# EAGLE design evse_ver3(擴充) (EAGLE 9.6.2)
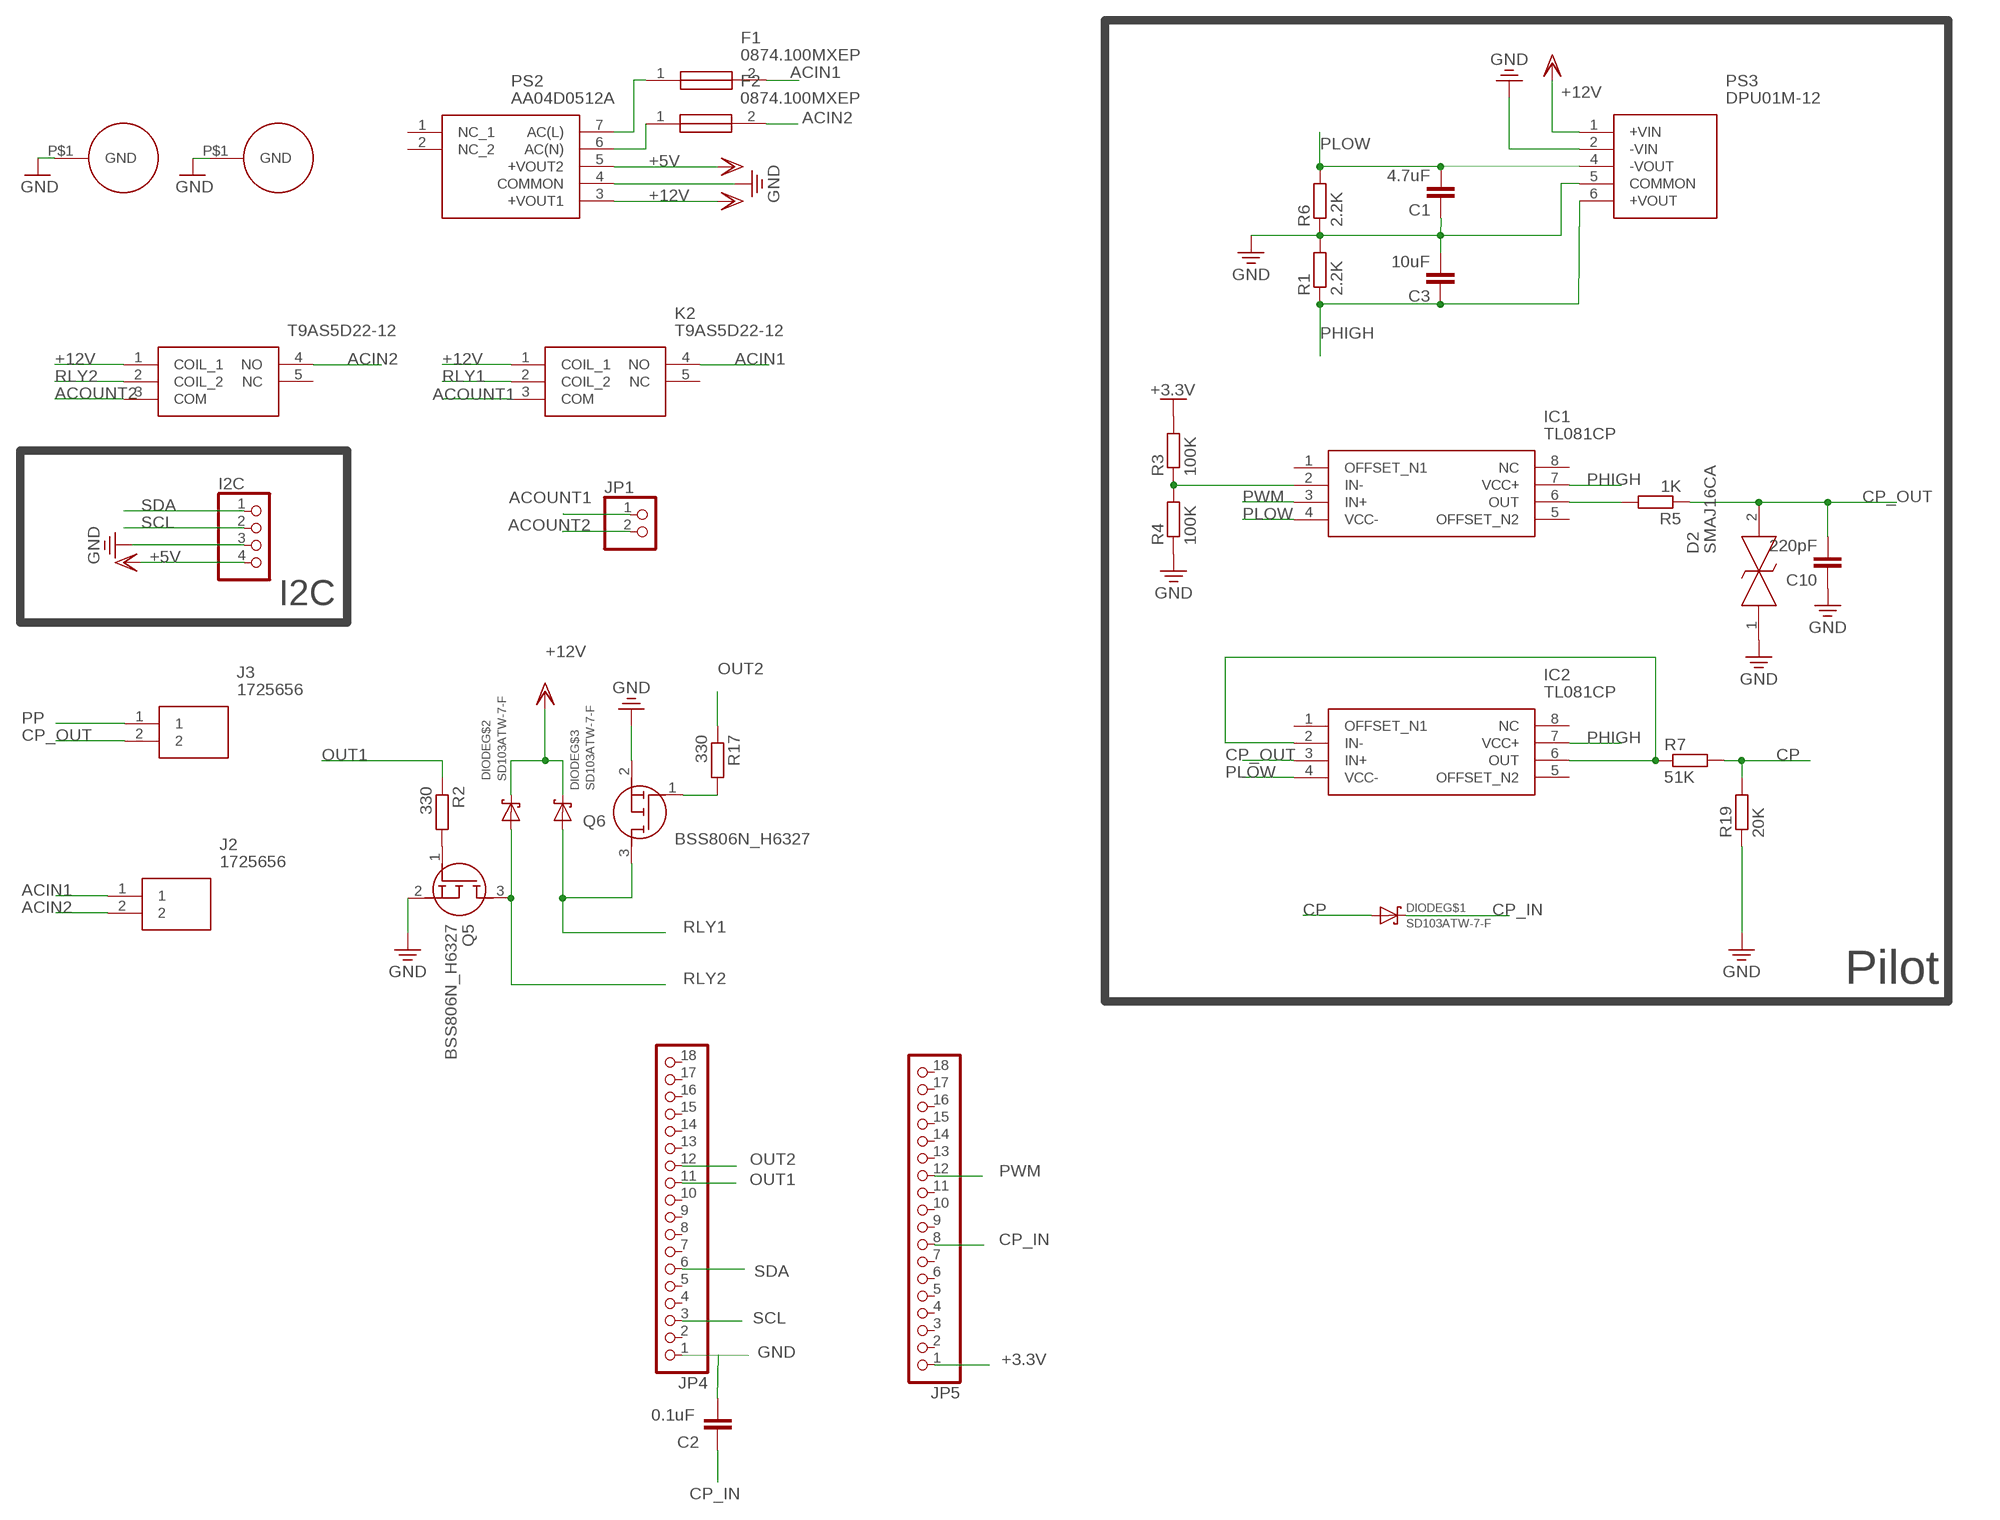
[diagram p0: schematic, sheet 1]

## Parts
C1  4.7uF  C-EUC0805  [C0805]
C2  0.1uF  C-EUC0805  [C0805]
C3  10uF  C-EUC0805  [C0805]
C10  220pF  C-EUC0805  [C0805]
D2  SMAJ16CA  [DIOM6626X229N]
DIODE  SD103ATW-7-F  [SOT363]
F1  0874.100MXEP  [0874100MXEP]
F2  0874.100MXEP  [0874100MXEP]
I2C  PINHD-1X4  [1X04]
IC1  TL081CP  [DIP794W53P254L959H508Q8N]
IC2  TL081CP  [DIP794W53P254L959H508Q8N]
J2  1725656  [1725656]
J3  1725656  [1725656]
JP1  PINHD-1X2  [1X02]
JP4  PINHD-1X18  [1X18]
JP5  PINHD-1X18  [1X18]
K2  T9AS5D22-12  [T9AS5D2224314191046]
K3  T9AS5D22-12  [T9AS5D2224314191046]
PS2  AA04D0512A  [AA04D0512A]
PS3  DPU01M-12  [DPU01M12]
Q5  BSS806N_H6327  [SOT95P240X110-3N]
Q6  BSS806N_H6327  [SOT95P240X110-3N]
R1  2.2K  R-EU_R0805  [R0805]
R2  330  R-EU_R0805  [R0805]
R3  100K  R-EU_R0805  [R0805]
R4  100K  R-EU_R0805  [R0805]
R5  1K  R-EU_R0805  [R0805]
R6  2.2K  R-EU_R0805  [R0805]
R7  51K  R-EU_R0805  [R0805]
R17  330  R-EU_R0805  [R0805]
R19  20K  R-EU_R0805  [R0805]
U$3  HOLE  [HOLE]
U$4  HOLE  [HOLE]

## Nets
+3.3V: JP5.1 R3.2
+5V: I2C.4 PS2.5(+VOUT2) ; supply symbol labelled VDD
+12V: DIODE.2(C) DIODE.3(C) K2.1(COIL_1) K3.1(COIL_1) PS2.3(+VOUT1) PS3.1(+VIN) ; supply symbol labelled VDD
ACIN1: F1.2 J2.1 K2.4(NO)
ACIN2: F2.2 J2.2 K3.4(NO)
ACOUNT1: JP1.1 K2.3(COM)
ACOUNT2: JP1.2 K3.3(COM)
CP: DIODE.6(A) R7.2 R19.2
CP_IN: C2.1 DIODE.1(C) JP5.8
CP_OUT: C10.2 D2.2 IC2.3(IN+) J3.2 R5.1
GND: C1.1 C2.2 C3.2 C10.1 D2.1 I2C.3 JP4.1 PS2.4(COMMON) PS3.2(-VIN) PS3.5(COMMON) Q5.2(S) Q6.2(S) R1.2 R4.1 R6.1 R19.1 U$3.P$1(GND) U$4.P$1(GND)
N$1: IC1.2(IN-) R3.1 R4.2
N$2: IC1.6(OUT) R5.2
N$4: Q5.1(G) R2.2
N$5: Q6.1(G) R17.2
N$6: IC2.2(IN-) IC2.6(OUT) R7.1
N$11: F2.1 PS2.6(AC(N))
N$12: F1.1 PS2.7(AC(L))
OUT1: JP4.11 R2.1
OUT2: JP4.12 R17.1
PHIGH: C3.1 IC1.7(VCC+) IC2.7(VCC+) PS3.6(+VOUT) R1.1
PLOW: C1.2 IC1.4(VCC-) IC2.4(VCC-) PS3.4(-VOUT) R6.2
PP: J3.1
PWM: IC1.3(IN+) JP5.12
RLY1: DIODE.4(A) K2.2(COIL_2) Q6.3(D)
RLY2: DIODE.5(A) K3.2(COIL_2) Q5.3(D)
SCL: I2C.2 JP4.3
SDA: I2C.1 JP4.6
Unconnected: IC1.1(OFFSET_N1) IC1.5(OFFSET_N2) IC1.8(NC) IC2.1(OFFSET_N1) IC2.5(OFFSET_N2) IC2.8(NC) JP4.2 JP4.4 JP4.5 JP4.7 JP4.8 JP4.9 JP4.10 JP4.13 JP4.14 JP4.15 JP4.16 JP4.17 JP4.18 JP5.2 JP5.3 JP5.4 JP5.5 JP5.6 JP5.7 JP5.9 JP5.10 JP5.11 JP5.13 JP5.14 JP5.15 JP5.16 JP5.17 JP5.18 K2.5(NC) K3.5(NC) PS2.1(NC_1) PS2.2(NC_2)

## Notes on the sheet
- I2C
- Pilot

## Library data of the parts
C1-C3 C10 = rcl:C-EU: CAPACITOR, European symbol
D2 = SMAJ16CA:SMAJ16CA: LITTELFUSE - SMAJ16CA - TVS Diode, SMAJ Series, Bidirectional, 16 V, 26 V, DO-214AC (SMA), 2 Pins Source: Datasheet <https://ms.componentsearchengine.com/Datasheets/2/SMAJ16CA.pdf>; DESCRIPTION: LITTELFUSE - SMAJ16CA - TVS Diode, SMAJ Series, Bidirectional, 16 V, 26 V, DO-214AC (SMA), 2 Pins; HEIGHT: 2.29mm; MANUFACTURER_NAME: LITTELFUSE; MANUFACTURER_PART_NUMBER: SMAJ16CA; MOUSER_PART_NUMBER: 576-SMAJ16CA; MOUSER_PRICE-STOCK: https://www.mouser.co.uk/ProductDetail/Littelfuse/SMAJ16CA?qs=zHiv0nsVGmph5UFEkGdy2g%3D%3D
DIODE = SD103ATW-7-F:SD103ATW-7-F: Diode array: 3x Such as http://www.digikey.com/product-search/en?part=SD103ATW-FDICT-ND Check availability <https://pricing.snapeda.com/parts/SD103ATW-7-F/Diodes%20Inc./view-part?ref=eda>; AVAILABILITY: In Stock; DESCRIPTION: Diode Array 3 Independent Schottky 40 V 175mA Surface Mount 6-TSSOP, SC-88, SOT-363; MF: Diodes Inc.; MP: SD103ATW-7-F; PACKAGE: SOT-363 Diodes Inc.; PRICE: None; PURCHASE-URL: https://pricing.snapeda.com/search/part/SD103ATW-7-F/?ref=eda
F1 F2 = 0874.100MXEP:0874.100MXEP: Cartridge Fuses 250V .100A 3.6X10 FA PT PB-FREE Source: Datasheet <https://componentsearchengine.com/Datasheets/1/0874.100MXEP.pdf>; DESCRIPTION: Cartridge Fuses 250V .100A 3.6X10 FA PT PB-FREE; HEIGHT: 3.6mm; MANUFACTURER_NAME: LITTELFUSE; MANUFACTURER_PART_NUMBER: 0874.100MXEP; MOUSER_PART_NUMBER: 576-0874.100MXEP; MOUSER_PRICE-STOCK: https://www.mouser.com/Search/Refine.aspx?Keyword=576-0874.100MXEP
I2C = pinhead:PINHD-1X4: PIN HEADER
IC1 IC2 = TL081CP:TL081CP: TL081CP, Operational Amplifier 3MHz, 8-Pin PDIP Source: Datasheet <http://www.ti.com/lit/ds/symlink/tl081a.pdf>; DESCRIPTION: TL081CP, Operational Amplifier 3MHz, 8-Pin PDIP; HEIGHT: 5.08mm; MANUFACTURER_NAME: Texas Instruments; MANUFACTURER_PART_NUMBER: TL081CP; MOUSER_PART_NUMBER: 595-TL081CP; MOUSER_PRICE-STOCK: https://www.mouser.co.uk/ProductDetail/Texas-Instruments/TL081CP?qs=xJkDX%2FqrskP5SC31s4Mqdg%3D%3D
J2 J3 = 1725656:1725656: PCB terminal block, nominal current: 6 A, rated voltage (III/2): 160 V, nominal cross section: 0.5 mm?, Number of potentials: 2, Number of rows: 1, Number of positions per row: 2, product range: MPT 0,5, pitch: 2.54 mm, connection method: Screw connection with tension sleeve, mounting: Wave soldering, conductor/PCB connection direction: 0 ?, color: green, Pin layout: Linear pinning, Solder pin [P]: 3.5 mm, type of packaging: packed in cardboard Source: Datasheet <https://www.phoenixcontact.com/online/portal/us/?uri=pxc-oc-itemdetail:pid=1725656&library=usen&pcck=P-11-01-05&tab=1&selectedCategory=ALL>; DESCRIPTION: PCB terminal block, nominal current: 6 A, rated voltage (III/2): 160 V, nominal cross section: 0.5 mm?, Number of potentials: 2, Number of rows: 1, Number of positions per row: 2, product range: MPT 0,5, pitch: 2.54 mm, connection method: Screw connection with tension sleeve, mounting: Wave soldering, conductor/PCB connection direction: 0 ?, color: green, Pin layout: Linear pinning, Solder pin [P]: 3.5 mm, type of packaging: packed in cardboard; HEIGHT: 8.65mm; MANUFACTURER_NAME: Phoenix Contact; MANUFACTURER_PART_NUMBER: 1725656; MOUSER_PART_NUMBER: 651-1725656; MOUSER_PRICE-STOCK: https://www.mouser.co.uk/ProductDetail/Phoenix-Contact/1725656?qs=Ul7CXFMnlWWQeccayYbRmw%3D%3D
JP1 = pinhead:PINHD-1X2: PIN HEADER
JP4 JP5 = pinhead:PINHD-1X18: PIN HEADER
K2 K3 = T9AS5D22-12:T9AS5D22-12: TE CONNECTIVITY / POTTER & BRUMFIELD - T9AS5D22-12 - RELAY, SPDT, 240VAC, 28VDC, 30A Source: Datasheet <https://componentsearchengine.com/Datasheets/1/T9AS5D22-12.pdf>; DESCRIPTION: TE CONNECTIVITY / POTTER & BRUMFIELD - T9AS5D22-12 - RELAY, SPDT, 240VAC, 28VDC, 30A; HEIGHT: mm; MANUFACTURER_NAME: TE Connectivity; MANUFACTURER_PART_NUMBER: T9AS5D22-12; MOUSER_PART_NUMBER: 655-T9AS5D22-12; MOUSER_PRICE-STOCK: https://www.mouser.co.uk/ProductDetail/TE-Connectivity-PB/T9AS5D22-12?qs=2jPFL06W5JVKA2uvXA%2F4Ew%3D%3D
PS2 = AA04D0512A:AA04D0512A: AC/DC Power Modules AC/DC Power Module, Dual Output, 5Vout, 12Vout, 4W Source: Datasheet <https://datasheet.datasheetarchive.com/originals/distributors/Datasheets-DGA21/91385.pdf>; DESCRIPTION: AC/DC Power Modules AC/DC Power Module, Dual Output, 5Vout, 12Vout, 4W; HEIGHT: 17.6mm; MANUFACTURER_NAME: Delta Electronics; MANUFACTURER_PART_NUMBER: AA04D0512A; MOUSER_PART_NUMBER: 108-AA04D0512A; MOUSER_PRICE-STOCK: https://www.mouser.co.uk/ProductDetail/Delta-Electronics/AA04D0512A/?qs=4hHWAozs7PZaLKDuE1lG%2FA%3D%3D
PS3 = DPU01M-12:DPU01M-12: Module DC-DC 12VIN 2-OUT 12V/-12V 0.042A/-0.042A 1W 5-Pin SIP Module Source: Datasheet <https://www.meanwell-web.com/content/files/pdfs/productPdfs/MW/DPU01/SPU01,DPU01-spec.pdf>; DESCRIPTION: Module DC-DC 12VIN 2-OUT 12V/-12V 0.042A/-0.042A 1W 5-Pin SIP Module; HEIGHT: 10.45mm; MANUFACTURER_NAME: Mean Well; MANUFACTURER_PART_NUMBER: DPU01M-12; MOUSER_PART_NUMBER: 709-DPU01M-12; MOUSER_PRICE-STOCK: https://www.mouser.co.uk/ProductDetail/MEAN-WELL/DPU01M-12?qs=5aG0NVq1C4yRPcZu7q8rLQ%3D%3D
Q5 Q6 = BSS806N_H6327:BSS806N_H6327: MOSFET N-Ch 20V 2.3A SOT-23-3 Source: Datasheet <https://www.mouser.it/datasheet/2/196/Infineon-BSS806N-DS-v02_03-en-918336.pdf>; DESCRIPTION: MOSFET N-Ch 20V 2.3A SOT-23-3; HEIGHT: 1.1mm; MANUFACTURER_NAME: Infineon; MANUFACTURER_PART_NUMBER: BSS806N H6327; MOUSER_PART_NUMBER: 726-BSS806NH6327XT; MOUSER_PRICE-STOCK: https://www.mouser.co.uk/ProductDetail/Infineon-Technologies/BSS806N-H6327?qs=oPPfIaWL1l2rNBcPXSFY%252BQ%3D%3D
R1-R7 R17 R19 = rcl:R-EU_: RESISTOR, European symbol
U$3 U$4 = OpenEVSE:HOLE

## Board
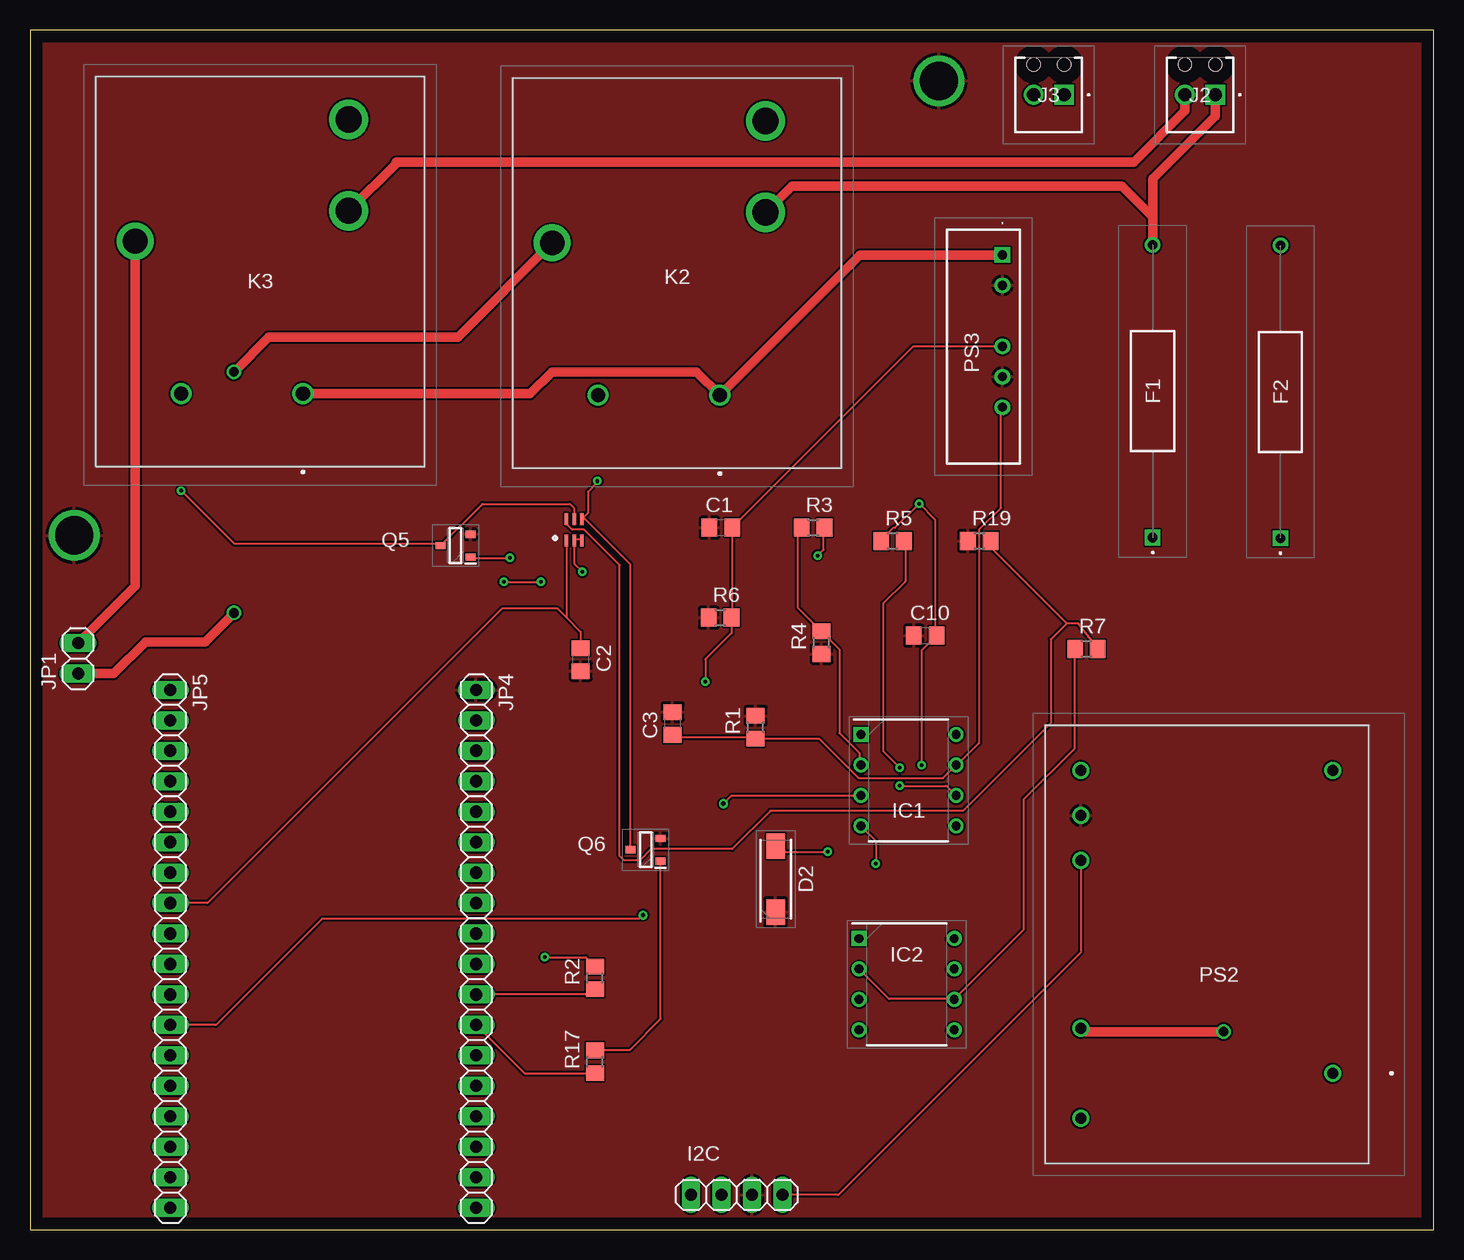
[diagram p1: board, top side]
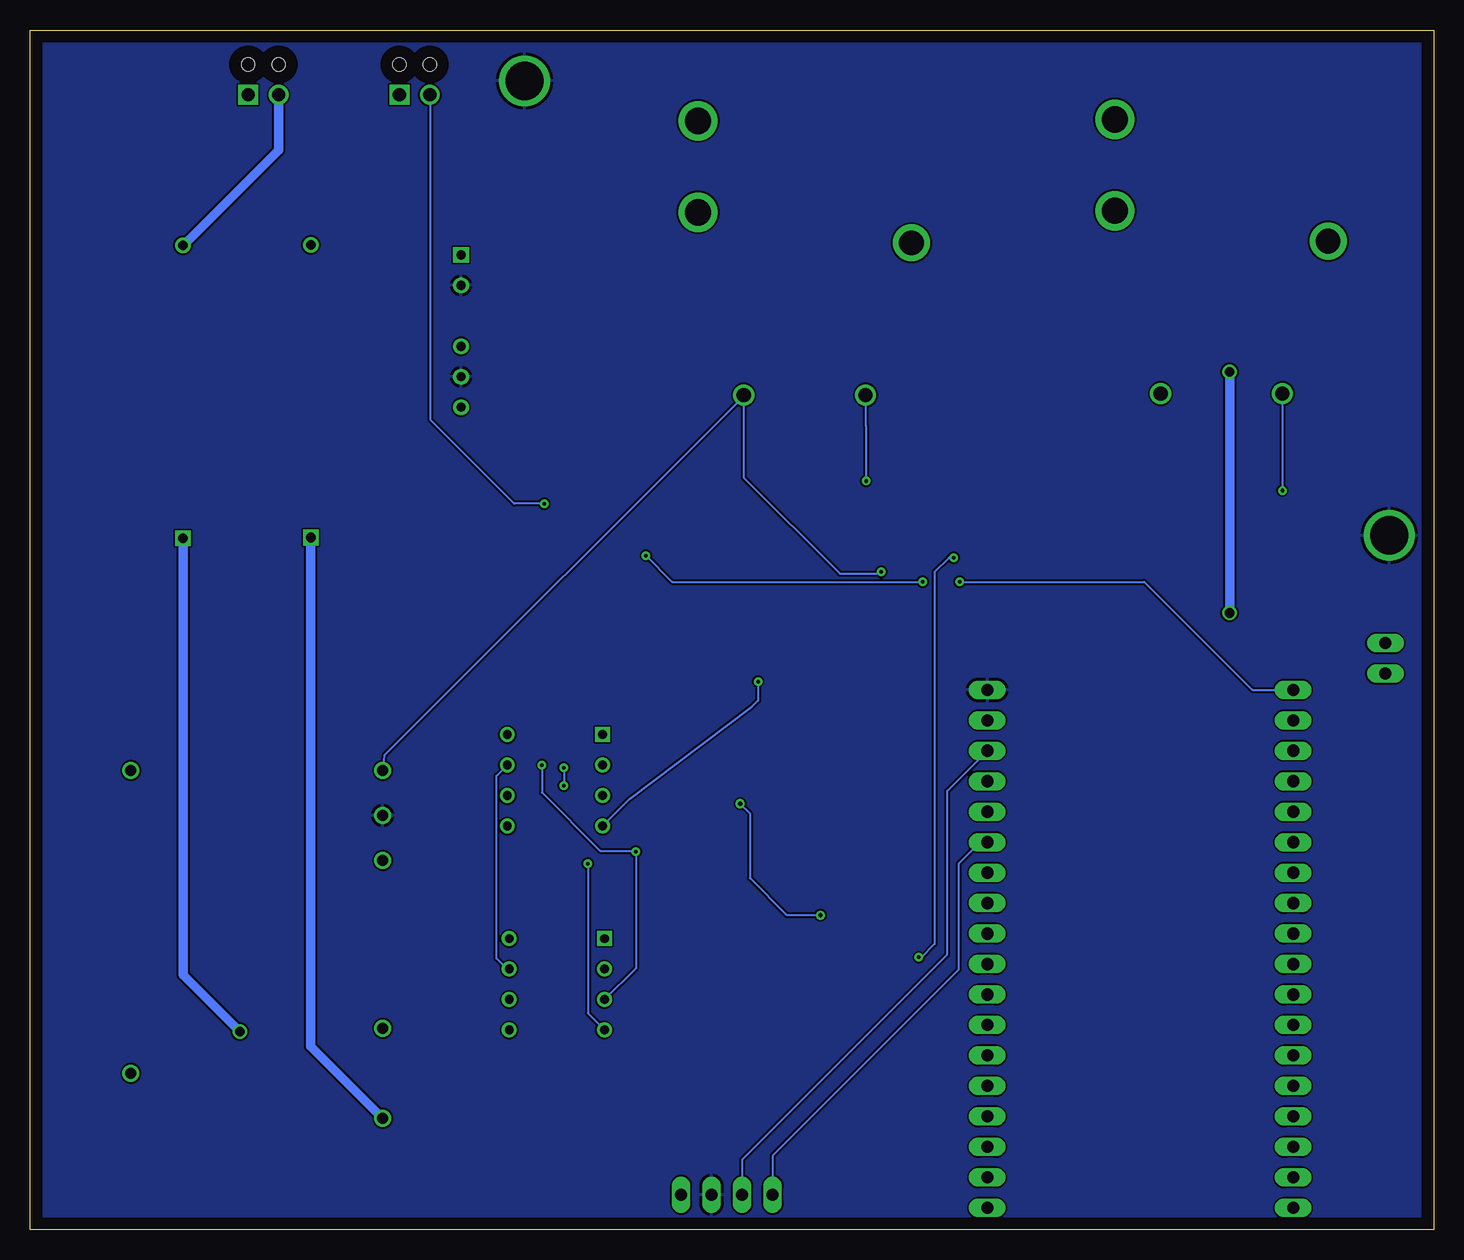
[diagram p2: board, bottom side, seen from below]

Size 117 x 100 mm. Coordinates in mm from the lower left corner, seen from the top.
Outline: 0,0 117,0 117,100 0,100 0,0
Copper layers (1*16): Top 0.035mm / dielectric 1.5mm / Bottom 0.035mm
Design rules "default *": minimum track width 0.18mm, minimum drill 0.3mm, track to track 6mil, track to pad 6mil, pad to pad 6mil, via to via 6mil, smd to smd 6mil, copper to edge 40mil, drill to drill 6mil, minimum pad ring 10mil, minimum via ring 8mil, stop-mask expansion 4mil, vias tented up to drill 0mil, thermal gap 10mil

### Footprints (pad centres in the part's own frame; a part is rotated, then mirrored left to right if it is on the bottom)
C0805 = smd 1.3 x 1.5: 1 -0.95,0; 2 0.95,0
DIOM6626X229N = smd 2.15 x 1.55: 1 -2.75,0; 2 2.75,0
SOT363 = smd 0.3 x 1: 1 -0.65,-0.9; 2 0,-0.9; 3 0.65,-0.9; 4 0.65,0.9; 5 0,0.9; 6 -0.65,0.9
0874100MXEP = drill 0.8 pad 1.3 square: 1 0,0 | drill 0.8 pad 1.3: 2 24.4,0
1X04 = drill 1.016 long: 1 -3.81,0; 2 -1.27,0; 3 1.27,0; 4 3.81,0
DIP794W53P254L959H508Q8N = drill 0.73 pad 1.13 square: 1 -3.97,3.81 | drill 0.73 pad 1.13: 2 -3.97,1.27; 3 -3.97,-1.27; 4 -3.97,-3.81; 5 3.97,-3.81; 6 3.97,-1.27; 7 3.97,1.27; 8 3.97,3.81
1725656 = drill 1.1 pad 1.65 square: 1 0,0 | drill 1.1 pad 1.65: 2 2.54,0 | hole 1.1: 0,-2.54; 2.54,-2.54
1X02 = drill 1.016 long: 1 -1.27,0; 2 1.27,0
1X18 = drill 1.016 long: 1 -21.59,0; 2 -19.05,0; 3 -16.51,0; 4 -13.97,0; 5 -11.43,0; 6 -8.89,0; 7 -6.35,0; 8 -3.81,0; 9 -1.27,0; 10 1.27,0; 11 3.81,0; 12 6.35,0; 13 8.89,0; 14 11.43,0; 15 13.97,0; 16 16.51,0; 17 19.05,0; 18 21.59,0
T9AS5D2224314191046 = drill 1.17 pad 1.755: 1 3.81,22.86; 2 13.97,22.86 | drill 2.06 pad 3.09: 3 17.78,10.16 | drill 2.19 pad 3.285: 4 0,7.62; 5 0,0
AA04D0512A = drill 0.9 pad 1.4: 1 0,0; 2 0,-25.25; 3 21,-25.25; 4 21,-21.5; 5 21,-17.75; 6 21,-3.75; 7 21,3.75
DPU01M12 = drill 0.76 pad 1.303 square: 1 0,0 | drill 0.76 pad 1.303: 2 2.54,0; 4 7.62,0; 5 10.16,0; 6 12.7,0
SOT95P240X110-3N = smd 0.85 x 0.6: 1 -1.25,0.95; 2 -1.25,-0.95; 3 1.25,0
R0805 = smd 1.3 x 1.5: 1 -0.95,0; 2 0.95,0
HOLE = drill 3.2 pad 3.81: P$1 0,0

### Placement (x,y rotation side)
C1  57.58,58.52 0 top
C2  45.9,47.5 270 top
C3  53.58,42.18 90 top
C10  74.63,49.52 0 top
D2  62.16,29.21 90 top
DIODE  45.36,58.34 0 top
F1  93.59,57.69 90 top
F2  104.24,57.63 90 top
I2C  58.91,2.89 0 top
IC1  73.24,37.45 0 top
IC2  73.08,20.45 0 top
J2  98.81,94.6 180 top
J3  86.2,94.6 180 top
JP1  4.01,47.62 90 top
JP4  37.2,23.4 270 top
JP5  11.7,23.4 270 top
K2  61.31,92.42 180 top
K3  26.56,92.55 180 top
PS2  108.6,13.02 180 top
PS3  81.06,81.25 270 top
Q5  35.47,57.01 180 top
Q6  51.32,31.66 180 top
R1  60.48,41.88 90 top
R2  47.09,20.98 90 top
R3  65.28,58.52 0 top
R4  65.98,48.93 90 top
R5  71.9,57.41 0 top
R6  57.53,51.02 0 top
R7  88.06,48.41 0 top
R17  47.09,13.99 90 top
R19  79.14,57.41 0 top
U$3  75.77,95.76 0 top
U$4  3.69,57.86 0 top

### Tracks (layer width: path | path; a pad name or v marks a point on that pad's centre or on a via)
+3.3V  (via drill 0.3)
  Top 0.18: v65.65,56.17 66.15,56.67 66.15,58.5 R3.2 | v39.5,54 v42.58,54
  Bottom 0.18: v65.65,56.17 63.48,54 v42.58,54 | JP5.1 15.1,44.99 24.11,54 v39.5,54
+5V
  Top 0.18: PS2.5 87.59,30.75 87.59,23.1 67.38,2.89 I2C.4
+12V  (via drill 0.3)
  Top 0.18: DIODE.3 45.87,57.51 45.37,57.51 DIODE.2 45.37,57.34 45.37,55.51 v46.04,54.84
  Top 0.8: K3.1 41.69,69.69 43.5,71.5 55.56,71.5 K2.1 69.19,81.25 PS3.1
  Bottom 0.18: v46.04,54.84 46.2,54.68 49.5,54.68 57.49,62.66 57.49,69.49 | K2.1 57.45,69.53 57.49,69.49 | 57.49,69.49 87.47,39.51 PS2.3
ACIN1
  Top 0.8: K2.4 63.51,87 91,87 93.59,84.41 F1.2 93.59,87.59 98.81,92.81 J2.1
ACIN2
  Top 0.8: K3.4 30.5,88.87 30.5,89 92,89 96.27,93.27 J2.2
  Bottom 0.8: J2.2 96.27,90 F2.2
ACOUNT1  (via drill 0.81)
  Top 0.8: K2.3 35.67,74.4 19.9,74.4 v17,71.5 | v17,51.4 14.6,49 9.64,49 6.99,46.35 JP1.1
  Bottom 0.8: v17,71.5 v17,51.4
ACOUNT2
  Top 0.8: JP1.2 8.78,53.66 K3.3
CP
  Top 0.18: 86.42,50.53 85.09,49.2 85.09,42.21 77.78,34.9 61.72,34.9 58.53,31.71 51.78,31.71 50.85,30.78 49.53,30.78 49.16,31.15 49.16,55.38 46.2,58.34 45.21,58.34 44.71,58.84 44.71,59.17 DIODE.6 | 86.42,50.53 87.37,50.53 R7.2 | 86.42,50.53 80.11,56.84 80.11,57.34 R19.2
CP_IN
  Top 0.18: 44.71,51.02 43.98,51.75 39.35,51.75 14.81,27.21 JP5.8 | DIODE.1 44.71,51.02 | C2.1 45.9,49.83 44.71,51.02
CP_OUT  (via drill 0.3)
  Top 0.18: D2.2 62.62,31.5 v66.5,31.5 | R5.1 70.97,57.51 71.97,58.5 72.12,58.5 v74.12,60.5 75.45,59.17 75.45,49.53 C10.2 74.32,48.26 v74.32,38.73
  Bottom 0.18: IC2.3 66.5,21.79 v66.5,31.5 66.65,31.58 69.47,31.58 74.32,36.42 v74.32,38.73 | v74.12,60.5 76.62,60.5 83.6,67.48 83.6,94.57 J3.2
GND
  pour Top: -8,102 -8,-5 122,-5 122,102
  pour Bottom: -10,103 -10,-8 -6,-8 126,-8 126,-1 126,103
N$1
  Top 0.18: R3.1 63.99,58.18 63.99,51.86 65.81,50.03 R4.2 65.98,49.86 67.48,48.36 67.48,41.38 69.14,39.72 69.14,38.73 IC1.2
N$2  (via drill 0.3)
  Top 0.18: R5.2 72.96,57.34 72.96,54.03 71.12,52.19 71.12,39.88 v72.5,38.5 | v72.5,37 76.39,37 IC1.6
  Bottom 0.18: v72.5,38.5 v72.5,37
N$4  (via drill 0.3)
  Top 0.18: Q5.1 36.78,56 v40,56 | v42.9,22.7 46.32,22.7 R2.2
  Bottom 0.18: v40,56 40.4,56 41.6,54.8 41.6,23.8 42.7,22.7 v42.9,22.7
N$5
  Top 0.18: R17.2 47.15,15 50,15 52.57,17.57 Q6.1
N$6
  Top 0.18: R7.1 87.09,48.36 87.09,40.12 82.85,35.88 82.85,25.01 77.12,19.28 IC2.6 77.01,19.22 71.61,19.22 IC2.2
N$11  (via drill 0.81)
  Top 0.8: v99.5,16.5 87.87,16.5 PS2.6
  Bottom 0.8: F2.1 104.24,21.24 v99.5,16.5
N$12
  Bottom 0.8: PS2.7 93.59,15.26 F1.1
OUT1
  Top 0.18: JP4.11 46.65,19.59 R2.1
OUT2
  Top 0.18: JP4.12 41.21,13.04 R17.1
PHIGH
  Top 0.18: C3.1 53.63,41.05 60.33,41.05 R1.1 60.5,40.88 65.81,40.88 69.07,37.63 76.12,37.63 IC1.7 77.28,38.72 79.11,40.55 79.11,58.34 80.94,60.16 80.94,68.47 PS3.6
  Bottom 0.18: IC2.7 77.23,21.72 78.11,22.6 78.11,37.82 IC1.7
PLOW  (via drill 0.3)
  Top 0.18: IC1.4 69.31,33.57 70.5,32.38 v70.5,30.5 | PS3.4 80.94,73.63 73.63,73.63 58.67,58.67 C1.2 58.5,58.5 58.5,51.02 R6.2 58.48,49.72 56.3,47.54 v56.3,45.67
  Bottom 0.18: v56.3,45.67 56.3,44.1 56.81,43.59 67.01,35.9 IC1.4 | v70.5,30.5 70.5,18.03 IC2.4
PWM  (via drill 0.35)
  Top 0.18: v57.8,35.5 58.48,36.18 IC1.3 | v51.1,26.2 50.8,25.9 24.35,25.9 15.5,17.05 JP5.12
  Bottom 0.18: v51.1,26.2 53.9,26.2 57,29.3 57,34.7 v57.8,35.5
RLY1  (via drill 0.3)
  Top 0.18: v47.3,62.4 47.3,62.3 46.5,61.5 46.5,59.73 DIODE.4 46.27,59.24 50.03,55.48 50.03,31.74 Q6.3
  Bottom 0.18: K2.2 47.34,67.04 47.3,67 v47.3,62.4
RLY2  (via drill 0.3)
  Top 0.18: v12.6,61.6 17,57.2 34.22,57.2 Q5.3 37.71,60.5 45,60.5 45.36,60.14 DIODE.5
  Bottom 0.18: K3.2 v12.6,61.6
SCL
  Bottom 0.18: JP4.3 40.53,36.58 40.53,22.93 57.64,5.82 I2C.2
SDA
  Bottom 0.18: JP4.6 37.81,32.29 39.6,30.5 39.6,21.66 55.1,6.16 I2C.1